# Altium schematic sheet Analog_Inputs_12V.SchDoc
size A4; SheetNumber: 7; SheetTotal: 13
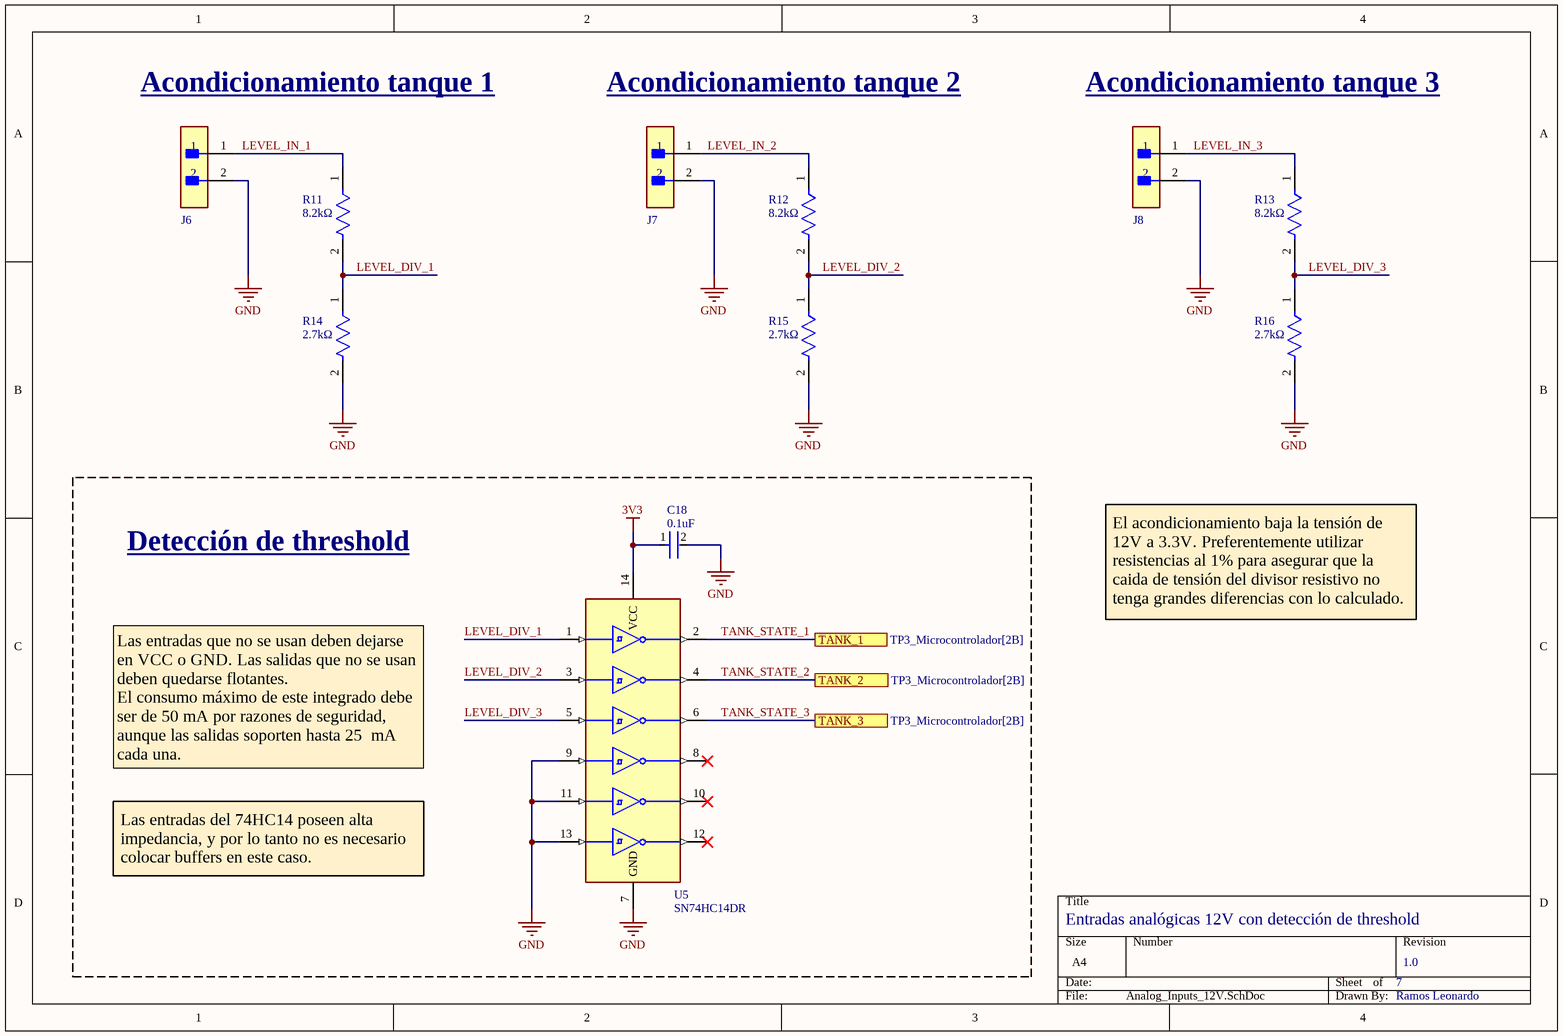
[diagram p0: Analog_Inputs_12V.SchDoc]

## Parts
C18  value 0.1uF  [FP-CC0805-0_85-MFG]  (hidden comment: CC0805KRX7R8BB104)
J6  26-60-4020  [FP-26-60-4020-MFG]  (value not drawn)
J7  26-60-4020  [FP-26-60-4020-MFG]  (value not drawn)
J8  26-60-4020  [FP-26-60-4020-MFG]  (value not drawn)
R11  Resistance: 8.2kΩ  [FP-CRCW0805-e3-IPC_B]  (hidden comment: CRCW08054K70JNEA)
R12  Resistance: 8.2kΩ  [FP-CRCW0805-e3-IPC_B]  (hidden comment: CRCW08054K70JNEA)
R13  Resistance: 8.2kΩ  [FP-CRCW0805-e3-IPC_B]  (hidden comment: CRCW08054K70JNEA)
R14  Resistance: 2.7kΩ  [FP-CRCW0805-e3-IPC_B]  (hidden comment: CRCW08054K70JNEA)
R15  Resistance: 2.7kΩ  [FP-CRCW0805-e3-IPC_B]  (hidden comment: CRCW08054K70JNEA)
R16  Resistance: 2.7kΩ  [FP-CRCW0805-e3-IPC_B]  (hidden comment: CRCW08054K70JNEA)
U5  SN74HC14DR  [FP-D0014A-IPC_C]

## Blocks framed on the sheet
Detección de threshold: C18 U5

## Ports
TANK_1 (see TP3_Microcontrolador[2B]), TANK_2 (see TP3_Microcontrolador[2B]), TANK_3 (see TP3_Microcontrolador[2B])

## Nets
3V3: C18.1 U5.14(VCC)
GND: C18.2 J6.2 J7.2 J8.2 R14.2 R15.2 R16.2 U5.7(GND) U5.9(4A) U5.11(5A) U5.13(6A)
LEVEL_DIV_1: R11.2 R14.1 U5.1(1A)
LEVEL_DIV_2: R12.2 R15.1 U5.3(2A)
LEVEL_DIV_3: R13.2 R16.1 U5.5(3A)
LEVEL_IN_1: J6.1 R11.1
LEVEL_IN_2: J7.1 R12.1
LEVEL_IN_3: J8.1 R13.1
TANK_STATE_1: U5.2(1Y) ; port TANK_1
TANK_STATE_2: U5.4(2Y) ; port TANK_2
TANK_STATE_3: U5.6(3Y) ; port TANK_3

Not connected (* = marked no-connect by the designer): U5 8(4Y)* 10(5Y)* 12(6Y)*

## Notes on the sheet
- Acondicionamiento tanque 1
- Acondicionamiento tanque 2
- Acondicionamiento tanque 3
- El acondicionamiento baja la tensión de 12V a 3.3V. Preferentemente utilizar resistencias al 1% para asegurar que la caida de tensión del divisor resistivo no tenga grandes diferencias con lo calculado.
- Las entradas que no se usan deben dejarse en VCC o GND. Las salidas que no se usan deben quedarse flotantes.
  El consumo máximo de este integrado debe ser de 50 mA por razones de seguridad, aunque las salidas soporten hasta 25  mA cada una.
- Las entradas del 74HC14 poseen alta impedancia, y por lo tanto no es necesario colocar buffers en este caso.
- Entradas analógicas 12V con detección de threshold
- 7
- 1.0
- Ramos Leonardo

## Library data of the parts
C18 = CMP-1036-04410-2: CAP CER 0.1UF 25V X7R 0805; Manufacturer: Yageo; Tolerance: 0.1; Material: Ceramic; Capacitance: 100 nF; ComponentLink2URL: http://www.yageo.com/documents/recent/UPY-GPHC_Y5V_6.3V-to-50V_8.pdf; Category: Cap; Mouser Description: Multilayer Ceramic Capacitors MLCC - SMD/SMT 100nF 25V X7R 10%; Manufacturer Part Number: CC0805KRX7R8BB104; Device Class L1: Passive Components; Footprint Url: http://www.yageo.com/exep/pages/download/literatures/UPY-C_GEN_24.pdf; Height: 0.95mm; Digikey Description: CAP CER 0.1UF 25V X7R 0805; Lead Free: Yes; Temperature Range High: +85°C; Temperature: -30°C to +85°C; Ipc Land Pattern Name: CAPC200125X85; Automotive: No; Octopart: https://octopart.com/cc0805krx7r8bb104-yageo-39467766; Device Class L2: Capacitors; Temperature Characteristic: X7R; Voltage Rating: 25 V; ComponentLink2Description: Datasheet; Temperature Range Low: -30°C; Device Class L3: Ceramic Capacitors; RoHS: TRUE; Package: CC0805-0.85
J6-J8 = CMP-04776-000303-1: CONN HEADER VERT 2POS 3.96MM; Number of Contacts: 2; Contact Resistance: 6mR; Current Rating: 7A; Gender: Male; Voltage Rating: 250V; Number of Lines: 1; Approvals: UL; Glow Wire Compliant: Non-compliant; Depth: 10.01mm; Color: Natural; Mount: Through Hole; Flammability Rating: UL94 V-0; Max Operating Temperature: 75°C; Termination: Solder; Lead Free: Lead Free; Length: 7.77mm; Height: 14.73mm; Min Operating Temperature: 0°C; Contact Gender: Male; Housing Material: Polyester; Number of Rows: 1; Material: Polyester; Fastening Type: Friction; Contact Material: Brass; Radiation Hardening: No; Pitch: 3.96mm; Number of Circuits: 2; Contact Plating: Tin; Packaging: Bulk; Housing Color: Natural; Contact Mating Length: 0.45inch; Contact Type: Male Pin; Number of Positions: 2; Orientation: Straight; Package Quantity: 1400; Series: KK® 41791; Max Voltage Rating (AC): 250V; RoHS Compliant: Yes; Max Current Rating: 7A; Number of Poles: 2
R11-R13 R15 R16 = CMP-2001-03967-2: RES Thick Film, 5%, 0.125W, 200ppm/°C, 0805; Power Rating: 125mW; Voltage Rating: 150V; Radiation Hardening: No; Case Code (Imperial): 0805; Military Standard: Not; Contact Plating: Tin; Weight: 0.000194oz; Mount: Surface Mount; Termination: SMD/SMT; Packaging: Tape and Reel; Min Operating Temperature: -55°C; Width: 1.25mm; Tolerance: 5%; Height: 0.45mm; Depth: 1.25mm; Length: 2mm; Temperature Coefficient: 200ppm/°C; Case Code (Metric): 2012; Package Quantity: 5000; Max Operating Temperature: 155°C; Case/Package: 0805; Composition: Thick Film
R14 = CMP-2001-03967-2: RES Thick Film,  5%, 0.125W, 200ppm/°C, 0805; Power Rating: 125mW; Voltage Rating: 150V; Radiation Hardening: No; Case Code (Imperial): 0805; Military Standard: Not; Contact Plating: Tin; Weight: 0.000194oz; Mount: Surface Mount; Termination: SMD/SMT; Packaging: Tape and Reel; Min Operating Temperature: -55°C; Width: 1.25mm; Tolerance: 5%; Height: 0.45mm; Depth: 1.25mm; Length: 2mm; Temperature Coefficient: 200ppm/°C; Case Code (Metric): 2012; Package Quantity: 5000; Max Operating Temperature: 155°C; Case/Package: 0805; Composition: Thick Film
U5 = CMP-1615-00273-4: IC INVERTER SCHMITT 6CH 14SOIC; Logic Function: Buffer; Max Supply Voltage: 6V; Propagation Delay: 155ns; Number of Elements: 6; Quiescent Current: 2uA; Number of Inputs: 1; High Level Output Current: -5.2mA; Turn-On Delay Time: 31ns; Min Supply Voltage: 2V; Low Level Output Current: 5.2mA; Operating Supply Voltage: 5V; Input Type: SCHMITT TRIGGER; Schmitt Trigger Input: Yes; REACH SVHC: No SVHC; Series: 74HC; Width: 3.91mm; Number of Pins: 14; Max Operating Temperature: 85°C; Length: 8.65mm; Radiation Hardening: No; Technology: CMOS; Number of Bits: 6; Case/Package: SOIC; Package Quantity: 2500; Number of Gates: 6; Lead Free: Lead Free; Number of Circuits: 6; Output Current: 5.2mA; Height: 1.58mm; Min Operating Temperature: -40°C; Contact Plating: Gold; RoHS Compliant: Yes; Weight: 0.004318oz; Mount: Surface Mount; Packaging: Tape and Reel